# Altium schematic sheet Shutdown_ckt.SchDoc
size A
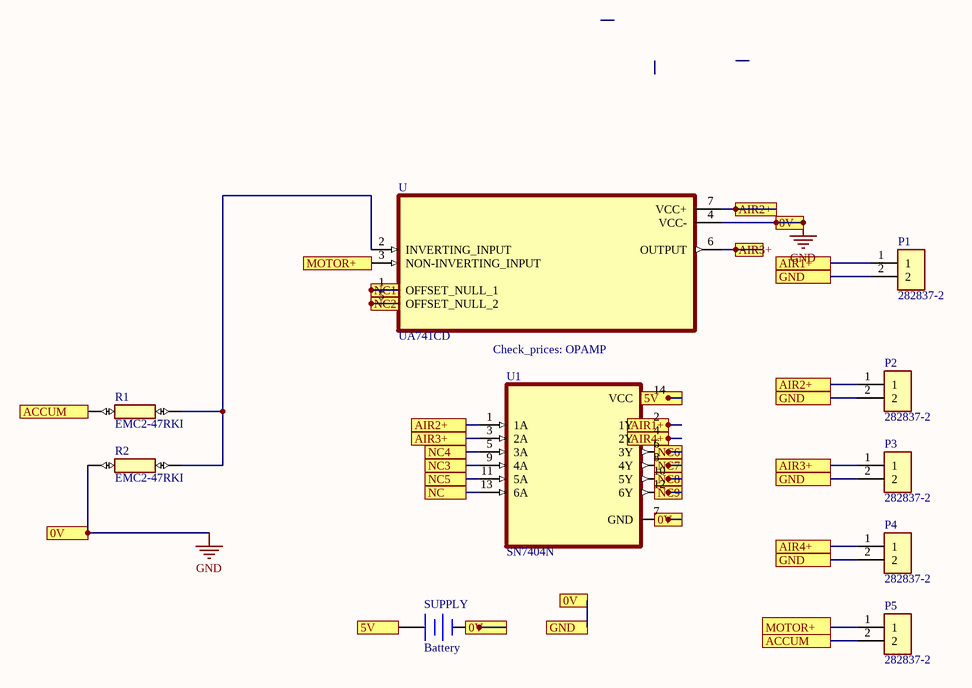
[diagram p0: Shutdown_ckt.SchDoc]

## Parts
P1  282837-2  [TE_282837-2]
P2  282837-2  [TE_282837-2]
P3  282837-2  [TE_282837-2]
P4  282837-2  [TE_282837-2]
P5  282837-2  [TE_282837-2]
R1  EMC2-47RKI  [RESAD2600W80L1000D400]
R2  EMC2-47RKI  [RESAD2600W80L1000D400]
SUPPLY  Battery  [BAT-2]
U  UA741CD  Check_prices: OPAMP  [SOIC127P599X175-8N]
U1  SN7404N  [DIP794W45P254L1969H508Q14]

## Ports
0V, 5V, ACCUM, AIR1+, AIR2+, AIR3+, AIR4+, GND, MOTOR+, NC, NC1, NC2, NC3, NC4, NC5, NC6, NC7, NC8, NC9

## Nets
GND: P1.2 P2.2 P3.2 P4.2 R2.1 SUPPLY.2(-) U.4(VCC-) U1.7(GND) ; port GND, port 0V
5V: SUPPLY.1(+) U1.14(VCC) ; port 5V
ACCUM: P5.2 R1.1 ; port ACCUM
AIR1+: P1.1 U1.2(1Y) ; port AIR1+
AIR2+: P2.1 U.7(VCC+) U1.1(1A) ; port AIR2+
AIR3+: P3.1 U.6(OUTPUT) U1.3(2A) ; port AIR3+
AIR4+: P4.1 U1.4(2Y) ; port AIR4+
MOTOR+: P5.1 U.3(NON-INVERTING_INPUT) ; port MOTOR+
NC: U1.13(6A) ; port NC
NC1: U.1(OFFSET_NULL_1) ; port NC1
NC2: U.5(OFFSET_NULL_2) ; port NC2
NC3: U1.9(4A) ; port NC3
NC4: U1.5(3A) ; port NC4
NC5: U1.11(5A) ; port NC5
NC6: U1.6(3Y) ; port NC6
NC7: U1.8(4Y) ; port NC7
NC8: U1.10(5Y) ; port NC8
NC9: U1.12(6Y) ; port NC9
NetR1_2: R1.2 R2.2 U.2(INVERTING_INPUT)

## Library data of the parts
P1-P5 = 282837-2: Ð Ð°Ð·ÑŠÐµÐ¼Ð½Ñ‹Ðµ ÐºÐ»ÐµÐ¼Ð¼Ð½Ñ‹Ðµ ÐºÐ¾Ð»Ð¾Ð´ÐºÐ¸ Ð Ð¾Ð·ÐµÑ‚ÐºÐ° 2 Ð¿Ð¾Ð»Ð¾Ð¶ÐµÐ½Ð¸Ñ 5,08 Ð¼Ð¼ ÐŸÑ€Ð¸Ð¿Ð¾Ð¹ Ð¿Ñ€ÑÐ¼Ð¾Ð¹ Ñ‡ÐµÑ€ÐµÐ· Ð¾Ñ‚Ð²ÐµÑ€ÑÑ‚Ð¸Ðµ 13,5 Ð / ÐºÐ¾Ð½Ñ‚Ð°ÐºÑ‚; MF: TE Connectivity; SnapEDA_Link: https://www.snapeda.com/parts/282837-2/TE+Connectivity+AMP+Connectors/view-part/?ref=snap; Price: None; Check_prices: https://www.snapeda.com/parts/282837-2/TE+Connectivity+AMP+Connectors/view-part/?ref=eda; Purchase-URL: https://pricing.snapeda.com/search/part/282837-2/?ref=eda; MP: 282837-2; Value: *; Availability: In Stock; Package: None
R1 R2 = EMC2-47RKI: RES 47 OHM 2W 10% AXIAL; MF: TT Electronics/Welwyn; SnapEDA_Link: https://www.snapeda.com/parts/EMC2-47RKI/TT+Electronics%252FWelwyn/view-part/?ref=snap; Package: None; Value: *; MP: EMC2-47RKI; Check_prices: https://www.snapeda.com/parts/EMC2-47RKI/TT+Electronics%252FWelwyn/view-part/?ref=eda
SUPPLY = Battery: Multicell Battery; Published: 24-Mar-1999; LatestRevisionDate: 17-Jul-2002; LatestRevisionNote: Re-released for DXP Platform.; PackageReference: BAT-2; Publisher: Altium Limited; PackageDescription: Battery; 2 Leads
U = UA741CD: General-Purpose Operational Amplifier 8-SOIC 0 to 70; MF: Texas Instruments; Price: None; Availability: Good; Value: *; MP: UA741CD; Mouser-Purchase-URL: https://snapeda.com/shop?store=Mouser&id=11613; DigiKey-Purchase-URL: https://snapeda.com/shop?store=DigiKey&id=11613; SnapEDA_Link: https://www.snapeda.com/parts/UA741CD/Texas%20Instruments/view-part/11613/?ref=snap; Package: SOIC-8 Texas Instruments; Texas_Instruments-Purchase-URL: https://snapeda.com/shop?store=Texas+Instruments&id=11613
U1 = SN7404N: 6-ch, 4.75-V to 5.25-V bipolar inverters; MF: Texas Instruments; Price: None; Availability: In Stock; Package: PDIP-14 Texas Instruments; MP: SN7404N; Value: *; SnapEDA_Link: https://www.snapeda.com/parts/SN7404N/Texas+Instruments/view-part/?ref=snap; Purchase-URL: https://pricing.snapeda.com/search/part/SN7404N/?ref=eda; Check_prices: https://www.snapeda.com/parts/SN7404N/Texas+Instruments/view-part/?ref=eda